# EAGLE design LOLDV22 (EAGLE 6.4)
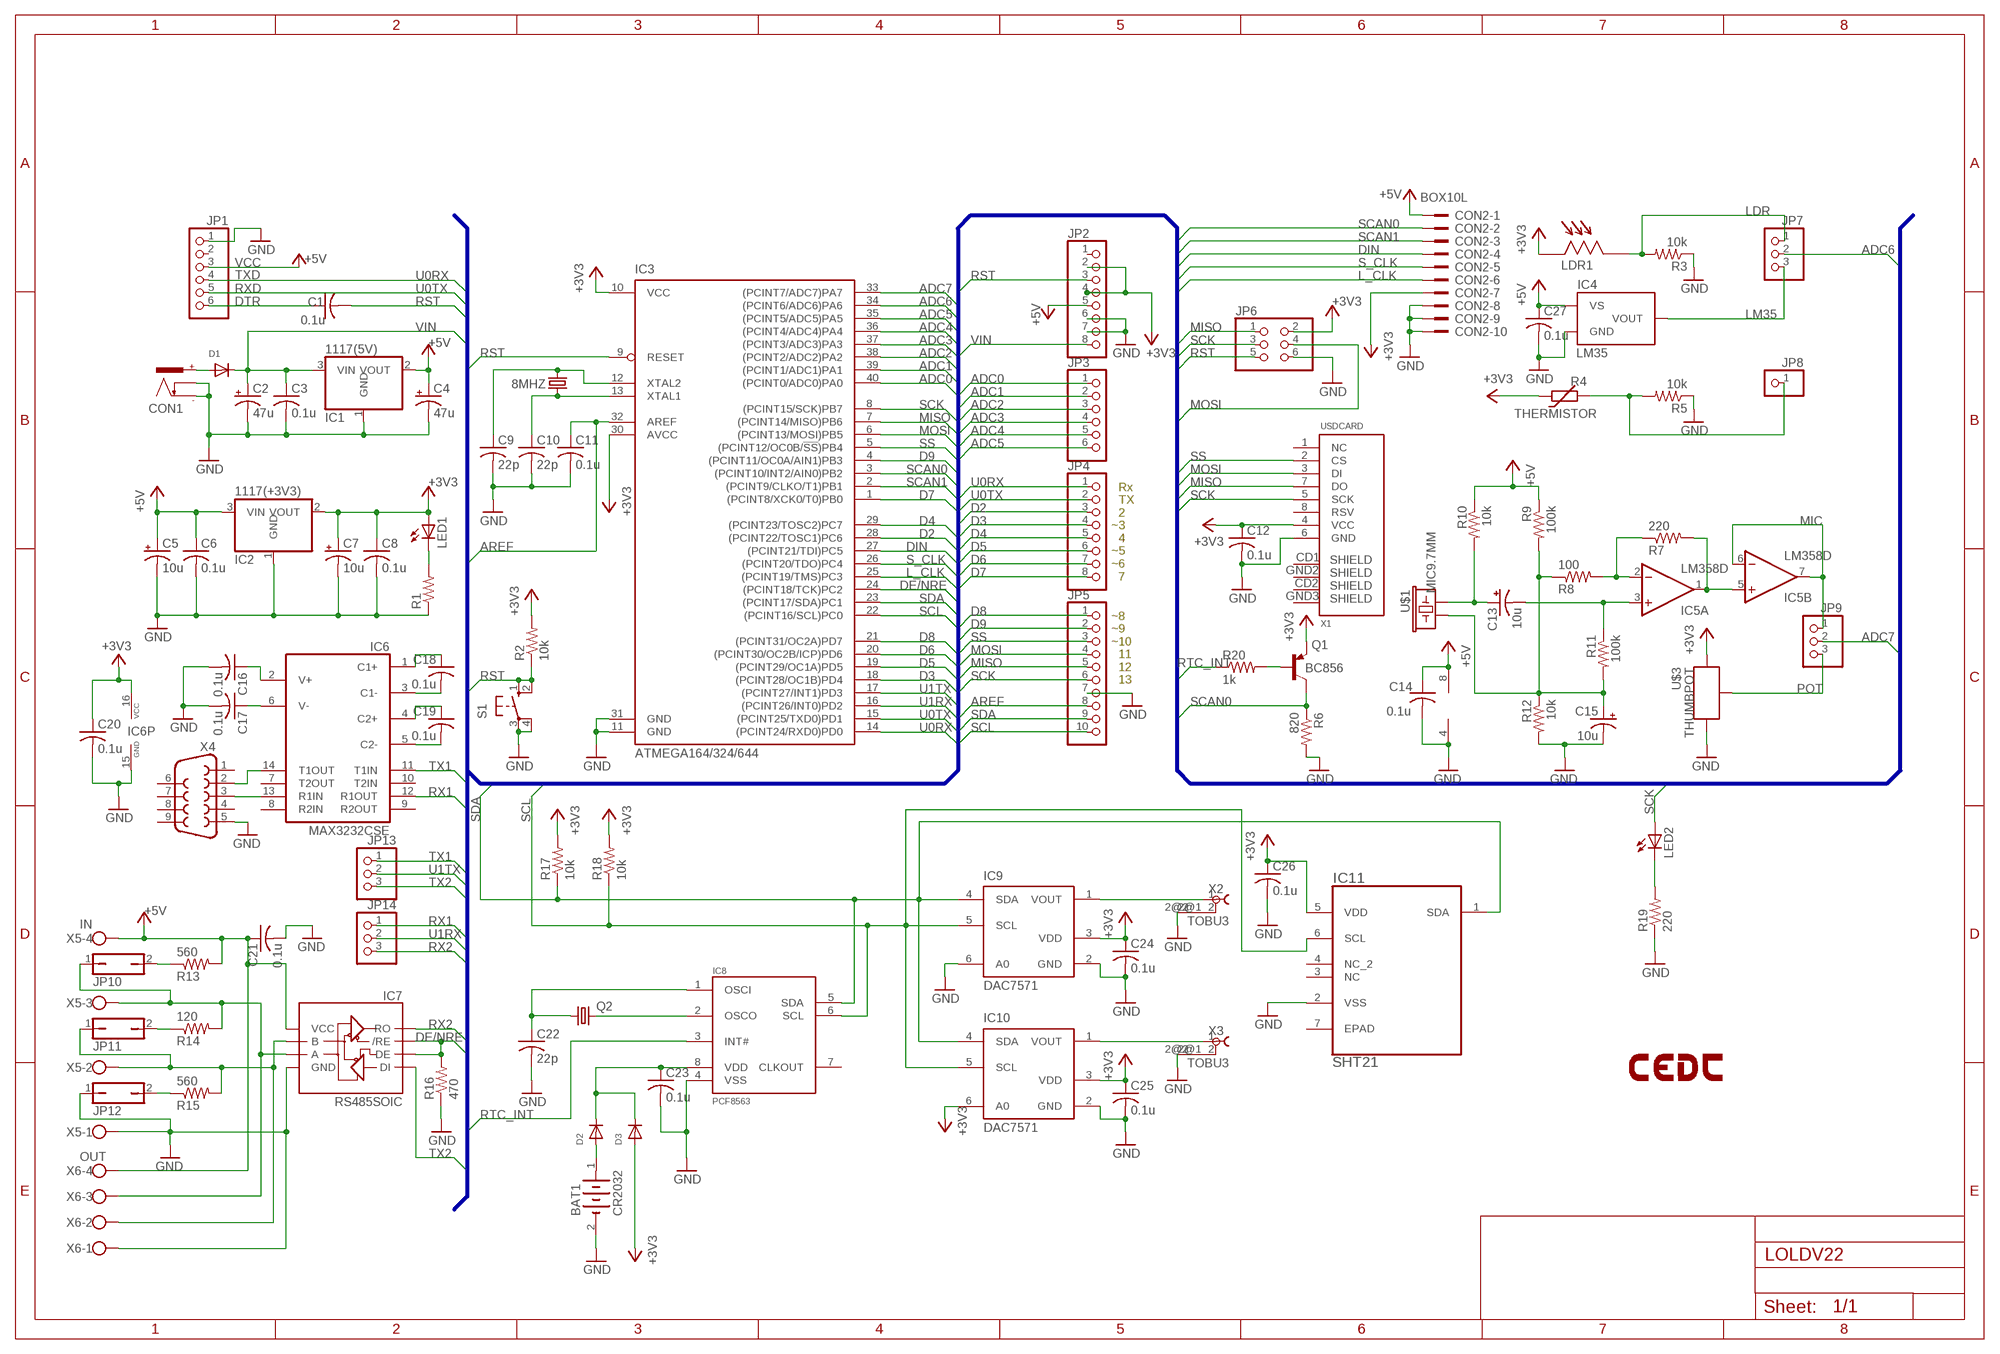
[diagram p0: schematic, sheet 1]

## Parts
8MHZ  CRYSTALHC49US  [HC49US]
BAT1  CR2032  [BATTCON_20MM]
C1  0.1u  CAP0805  [C0805]
C2  47u  CPOL-USE3.5-8  [E3,5-8]
C3  0.1u  CAP0805  [C0805]
C4  47u  CPOL-USE3.5-8  [E3,5-8]
C5  10u  CAP_POL_10V  [C/6032-28R]
C6  0.1u  CAP0805  [C0805]
C7  10u  CAP_POL_10V  [C/6032-28R]
C8  0.1u  CAP0805  [C0805]
C9  22p  CAP0805  [C0805]
C10  22p  CAP0805  [C0805]
C11  0.1u  CAP0805  [C0805]
C12  0.1u  CAP0805  [C0805]
C13  10u  CAP_POL_10V  [C/6032-28R]
C14  0.1u  CAP0805  [C0805]
C15  10u  CAP_POL_10V  [C/6032-28R]
C16  0.1u  CAP0805  [C0805]
C17  0.1u  CAP0805  [C0805]
C18  0.1u  CAP0805  [C0805]
C19  0.1u  CAP0805  [C0805]
C20  0.1u  CAP0805  [C0805]
C21  0.1u  CAP0805  [C0805]
C22  22p  CAP0805  [C0805]
C23  0.1u  CAP0805  [C0805]
C24  0.1u  CAP0805  [C0805]
C25  0.1u  CAP0805  [C0805]
C26  0.1u  CAP0805  [C0805]
C27  0.1u  CAP0805  [C0805]
CON1  POWER_CON  [NEB21R]
CON2  BOX10L  [BOX10L]
D1  DIODESMA  [SMADIODE]
D2  DIODESMA  [SMADIODE]
D3  DIODESMA  [SMADIODE]
IC1  1117(5V)  REG1117  [SOT223]
IC2  1117(+3V3)  REG1117  [SOT223]
IC3  ATMEGA164/324/644  [DIP40]
IC4  LM35  [TO92]
IC5  LM358D  [SO08]
IC6  MAX3232CSE  [SO16]
IC7  RS485SOIC  [SO08]
IC8  PCF8563  PCF8563SO8  [SOIC8]
IC9  DAC7571  [SOT23-6]
IC10  DAC7571  [SOT23-6]
IC11  SHT21  [DFN300X300X110-7N]
JP1  PINHD-1X6  [1X06]
JP2  PINHD-1X8  [1X08]
JP3  PINHD-1X6  [1X06]
JP4  PINHD-1X8  [1X08]
JP5  PINHD-1X10  [1X10]
JP6  PINHD-2X3  [2X03]
JP7  PINHD-1X3  [1X03]
JP8  PINHD-1X1  [1X01]
JP9  PINHD-1X3  [1X03]
JP10  JP1Q  [JP1]
JP11  JP1Q  [JP1]
JP12  JP1Q  [JP1]
JP13  PINHD-1X3  [1X03]
JP14  PINHD-1X3  [1X03]
LDR1  CDSLDR3MM  [LDR3MM]
LED1  LED1206  [CHIPLED_1206]
LED2  LED1206  [CHIPLED_1206]
LOGO1  LOGO-CEDTSILK-18MM  [LOGO-CEDT-SILK-18MM]
Q1  BC856  BC856ASMD  [SOT23-BEC]
Q2  CRYSTALTC26H  [TC26H]
R1  RESISTOR0805  [R0805]
R2  10k  RESISTOR0805  [R0805]
R3  10k  RESISTOR0805  [R0805]
R4  THERMISTOR  THERMISTOR-5  [R-5]
R5  10k  RESISTOR0805  [R0805]
R6  820  RESISTOR0805  [R0805]
R7  220  RESISTOR0805  [R0805]
R8  100  RESISTOR0805  [R0805]
R9  100k  RESISTOR0805  [R0805]
R10  10k  RESISTOR0805  [R0805]
R11  100k  RESISTOR0805  [R0805]
R12  10k  RESISTOR0805  [R0805]
R13  560  RESISTOR0805  [R0805]
R14  120  RESISTOR0805  [R0805]
R15  560  RESISTOR0805  [R0805]
R16  470  RESISTOR0805  [R0805]
R17  10k  RESISTOR0805  [R0805]
R18  10k  RESISTOR0805  [R0805]
R19  220  RESISTOR0805  [R0805]
R20  1k  RESISTOR0805  [R0805]
S1  10-XX  [B3F-10XX]
U$1  MIC9.7MM  [MIC-9.7MM]
U$3  THUMBPOT  [THUMBPOT]
X1  USDCARD  [USD-SOCKET-PUSHTYPE]
X2  TOBU3  [TOBU3]
X3  TOBU3  [TOBU3]
X4  DB9  [DB9]
X5  IN  W237-4  [W237-4]
X6  OUT  W237-4  [W237-4]

## Nets
16MHZ: 8MHZ.2 C9.1 IC3.12(XTAL2)
+3V3 [power]: C7.+ C8.1 C12.1 C20.1 C24.1 C25.1 C26.1 CON2.7 D3.A IC2.2(VOUT) IC3.10(VCC) IC3.30(AVCC) IC6.16(VCC) IC9.3(VDD) IC10.3(VDD) IC10.6(A0) IC11.5(VDD) JP2.2 JP2.4 JP6.2 LDR1.P$1 LED1.A Q1.E R2.2 R4.1 R17.2 R18.2 U$3.1(E) X1.4(VCC)
+5V [power]: C4.+ C5.+ C6.1 C14.1 C21.1 C27.1 CON2.1 IC1.2(VOUT) IC2.3(VIN) IC4.VS IC5.8(P:V+) IC7.8(VCC) JP1.3 JP2.5 R9.1 R10.1 R13.2 X5.4 X6.4
ADC0: IC3.40((PCINT0/ADC0)PA0) JP3.1
ADC1: IC3.39((PCINT1/ADC1)PA1) JP3.2
ADC2: IC3.38((PCINT2/ADC2)PA2) JP3.3
ADC3: IC3.37((PCINT3/ADC3)PA3) JP3.4
ADC4: IC3.36((PCINT4/ADC4)PA4) JP3.5
ADC5: IC3.35((PCINT5/ADC5)PA5) JP3.6
ADC6: IC3.34((PCINT6/ADC6)PA6) JP7.2
ADC7: IC3.33((PCINT7/ADC7)PA7) JP9.2
AREF: C11.1 IC3.32(AREF) JP5.8
D2: IC3.28((PCINT22/TOSC1)PC6) JP4.3
D3: IC3.18((PCINT28/OC1B)PD4) JP4.4
D4: IC3.29((PCINT23/TOSC2)PC7) JP4.5
D5: IC3.19((PCINT29/OC1A)PD5) JP4.6
D6: IC3.20((PCINT30/OC2B/ICP)PD6) JP4.7
D7: IC3.1((PCINT8/XCK0/T0)PB0) JP4.8
D8: IC3.21((PCINT31/OC2A)PD7) JP5.1
D9: IC3.4((PCINT11/OC0A/AIN1)PB3) JP5.2
DE/NRE: IC3.24((PCINT18/TCK)PC2) IC7.2(/RE) IC7.3(DE) R16.2
DIN: CON2.4 IC3.27((PCINT21/TDI)PC5)
DTR: C1.1 JP1.6
GND [power]: BAT1.2(-) C2.- C3.2 C4.- C5.- C6.2 C7.- C8.2 C9.2 C10.2 C11.2 C12.2 C14.2 C15.- C16.2 C17.2 C20.2 C21.2 C22.2 C23.2 C24.2 C25.2 C26.2 C27.2 CON1.- CON1.C CON2.8 CON2.9 CON2.10 IC1.1(GND) IC2.1(GND) IC3.11(GND) IC3.31(GND) IC4.GND IC5.4(P:V-) IC6.15(GND) IC7.5(GND) IC8.4(VSS) IC9.2(GND) IC9.6(A0) IC10.2(GND) IC11.2(VSS) JP1.1 JP2.6 JP2.7 JP5.7 JP6.6 JP12.1 R1.1 R3.1 R5.1 R6.2 R12.2 R16.1 R19.1 S1.3(P) S1.4(P1) U$3.3(A) X1.6(GND) X2.2@2 X3.2@2 X4.5 X5.1 X6.1
L_CLK: CON2.6 IC3.25((PCINT19/TMS)PC3)
LDR: JP7.1 LDR1.P$2 R3.2
LM35: IC4.VOUT JP7.3
MIC: IC5.6(B:-IN) IC5.7(B:OUT) JP9.1
MISO: IC3.7((PCINT14/MISO)PB6) JP5.5 JP6.1 X1.7(DO)
MOSI: IC3.6((PCINT13/MOSI)PB5) JP5.4 JP6.4 X1.3(DI)
N$1: 8MHZ.1 C10.1 IC3.13(XTAL1)
N$2: IC5.2(A:-IN) R7.1 R8.2
N$3: C13.+ R10.2 U$1.1
N$4 [power]: CON1.+ D1.A
N$5: C13.- IC5.3(A:+IN) R11.1
N$7: IC6.14(T1OUT) X4.2
N$8: IC5.1(A:OUT) IC5.5(B:+IN) R7.2
N$9: LED1.C R1.2
N$10: IC10.1(VOUT) X3.1
N$11: IC9.1(VOUT) X2.1
N$12: Q1.B R20.2
N$13: JP8.1 R4.2 R5.2
N$14 [power]: BAT1.1(+) D2.A
N$15: C19.1 IC6.4(C2+)
N$16: LED2.C R19.2
N$17: C19.2 IC6.5(C2-)
N$18: IC6.13(R1IN) X4.3
N$19: C18.2 IC6.3(C1-)
N$20: C18.1 IC6.1(C1+)
N$21: C17.1 IC6.6(V-)
N$22: C16.1 IC6.2(V+)
N$23: IC8.2(OSCO) Q2.2
N$24: C22.1 IC8.1(OSCI) Q2.1
N$25 [power]: C23.1 D2.C D3.C IC8.8(VDD)
N$26: IC7.7(B) JP11.1 R15.2 X5.2 X6.2
N$27: JP10.2 R13.1
N$33: C15.+ R8.1 R9.2 R11.2 R12.1 U$1.2
N$42: IC7.6(A) JP10.1 R14.2 X5.3 X6.3
N$43: JP11.2 R14.1
N$45: JP12.2 R15.1
POT: JP9.3 U$3.2(S)
RST: C1.2 IC3.9(RESET) JP2.3 JP6.5 R2.1 S1.1(S) S1.2(S1)
RTC_INT: IC8.3(INT#) R20.1
RX1: IC6.12(R1OUT) JP14.1
RX2: IC7.1(RO) JP14.3
S_CLK: CON2.5 IC3.26((PCINT20/TDO)PC4)
SCAN0: CON2.2 IC3.3((PCINT10/INT2/AIN0)PB2) Q1.C R6.1
SCAN1: CON2.3 IC3.2((PCINT9/CLKO/T1)PB1)
SCK: IC3.8((PCINT15/SCK)PB7) JP5.6 JP6.3 LED2.A X1.5(SCK)
SCL: IC3.22((PCINT16/SCL)PC0) IC8.6(SCL) IC9.5(SCL) IC10.5(SCL) IC11.6(SCL) JP5.10 R18.1
SDA: IC3.23((PCINT17/SDA)PC1) IC8.5(SDA) IC9.4(SDA) IC10.4(SDA) IC11.1(SDA) JP5.9 R17.1
SS: IC3.5((PCINT12/OC0B/!SS!)PB4) JP5.3 X1.2(CS)
TX1: IC6.11(T1IN) JP13.1
TX2: IC7.4(DI) JP13.3
U0RX: IC3.14((PCINT24/RXD0)PD0) JP1.4 JP4.1
U0TX: IC3.15((PCINT25/TXD0)PD1) JP1.5 JP4.2
U1RX: IC3.16((PCINT26/INT0)PD2) JP14.2
U1TX: IC3.17((PCINT27/INT1)PD3) JP13.2
VIN [power]: C2.+ C3.1 D1.C IC1.3(VIN) JP2.8
Unconnected: IC6.7(T2OUT) IC6.8(R2IN) IC6.9(R2OUT) IC6.10(T2IN) IC8.7(CLKOUT) IC11.3(NC) IC11.4(NC_2) IC11.7(EPAD) JP1.2 JP2.1 X1.1(NC) X1.8(RSV) X1.CD1 X1.CD2 X1.GND2 X1.GND3 X2.2 X2.2@1 X3.2 X3.2@1 X4.1 X4.4 X4.6 X4.7 X4.8 X4.9

## Buses
AREF,ADC[0..7],SS,MOSI,MISO,SCK,RX[1..2],TX[1..2],RST,VIN,SDA,SCL,PWM[0..4],GPIO[0..2],L_CLK,S_CLK,DIN,SCAN1,SCAN0,BBS,RTC_INT,D[2..9],DE/NRE,U0RX,U0TX,U1RX,U1TX

## Notes on the sheet
- VCC
- TXD
  RXD
- Rx 
    TX
    2
  ~3
    4
  ~5
  ~6
    7
- ~8
  ~9
  ~10
    11
    12
    13

## Library data of the parts
8MHZ Q2 = CEDTv73:CRYSTAL: Crystals Various standard crystals. Proven footprints. Spark Fun Electronics SKU : COM-00534
BAT1 = CEDTv73:CR2032
C1 C3 C6 C8-C12 C14 C16-C20 C22-C27 = CEDTv73:CAP
C2 C4 = resistor:CPOL-US: POLARIZED CAPACITOR, American symbol
C5 C7 C13 C15 = CEDTv73:CAP_POL
C21 = CEDTv63:CAP
CON1 = CEDTv73:POWER_CON: DC Power Connector
CON2 = CEDTv73:BOX10: 3M (TM) Pak 100 4-Wall Header Source: 3M
D1-D3 = adafruit:DIODE: Diode SMADIODE - SMA Surface Mount Package 20V 1A Schottky Diode Digikey: 641-1014-6-ND DO-1N4148 - Through Hole Small Current Diode SOD-123 20V 1 A (.5mV Vf) Schottky Diode - Digikey: MBRX120TPMSCT-ND SOD-323 10V 570mA (.38mV Vf, 3ns) Schottky Diode - Digikey: ZLLS410CT-ND SOD-523 30V 30mA Schottky Diode (RB751S-40TE61) - Digikey: RB751S-40TE61CT-ND SOT23-R/W - SOT23 Package (R = Solder Paste/Reflow Ovens, W = Hand-Soldering) BAT54Film 40V 300mA - Digikey: 497-7162-1-ND
IC1 IC2 = CEDTv73:REG1117: 800mA and 1A Low Dropout (LDO) Positive Regulator 1.8V, 2.5V, 2.85V, 3.3V, 5V, and Adj
IC3 = atmega_164_324_644:ATMEGA164/324/644
IC4 = CEDTv73:LM35
IC5 = CEDTv73:LM358: OP AMP also LM158; LM258; LM2904 Source: http://cache.national.com/ds/LM/LM158.pdf
IC6 = maxim:MAX3232*: True RS-232 Transceivers 3.0V to 5.5V, Low-Power up to 1Mbps, Using Four 0.1µF External Capacitors Source: http://pdfserv.maxim-ic.com/en/ds/MAX3222-MAX3241.pdf
IC7 = sparkfun:RS485
IC8 = CEDTv73:PCF8563
IC9 IC10 = CEDTv73:DAC7571
IC11 = SHT21:SHT21: SENSOR, HUMIDITY & TEMP; MPN: SHT21; OC_FARNELL: 1855468; OC_NEWARK: 20T1172; PACKAGE: DFN-6; SUPPLIER: SENSIRION
JP1 JP3 = pinhead:PINHD-1X6: PIN HEADER
JP2 JP4 = pinhead:PINHD-1X8: PIN HEADER
JP5 = pinhead:PINHD-1X10: PIN HEADER
JP6 = pinhead:PINHD-2X3: PIN HEADER
JP7 = jumper01x03:PINHD-1X3
JP8 = pinhead:PINHD-1X1: PIN HEADER
JP9 JP13 JP14 = pinhead:PINHD-1X3: PIN HEADER
JP10-JP12 = jumper:JP1Q: JUMPER
LDR1 = CEDTv73:CDSLDR3MM
LED1 LED2 = CEDTv73:LED
LOGO1 = CEDTv73:LOGO-CEDT
Q1 = transistor-pnp:BC856*: PNP Transistror
R1-R3 R5 R6 R17-R20 = CEDTv73:RESISTOR
R4 = varistor:THERMISTOR: THERMISTOR
R7-R12 = CEDTv71:RESISTOR
R13-R16 = CEDTv63:RESISTOR
S1 = CEDTv73:10-XX: OMRON SWITCH
U$1 = CEDTv73:MIC: Microphone Omni-directional electret microphone. 9.7mm standard diameter.
U$3 = CEDTv73:THUMBPOT
X1 = CEDTv73:USDCARD: Amphenol Micro SD None Push Connector Part No: - 114-00841-68-1-ND
X2 X3 = CEDTv73:TOBU3: Female Cinch CONNECTOR ( RCA Jack )
X4 = sparkfun:DB9: DB9 Connector Standard DB9 (D-Sub 9) serial connector. Can be used for CAN bus as well as RS485 and RS232. Footprint production proven. Spark Fun Electronics SKU : PRT-00429
X5 X6 = con-wago-500:W237-4: WAGO SCREW CLAMP

## Net classes
0 default: width 0.305 mm
1 power: width 0.406 mm

## Board
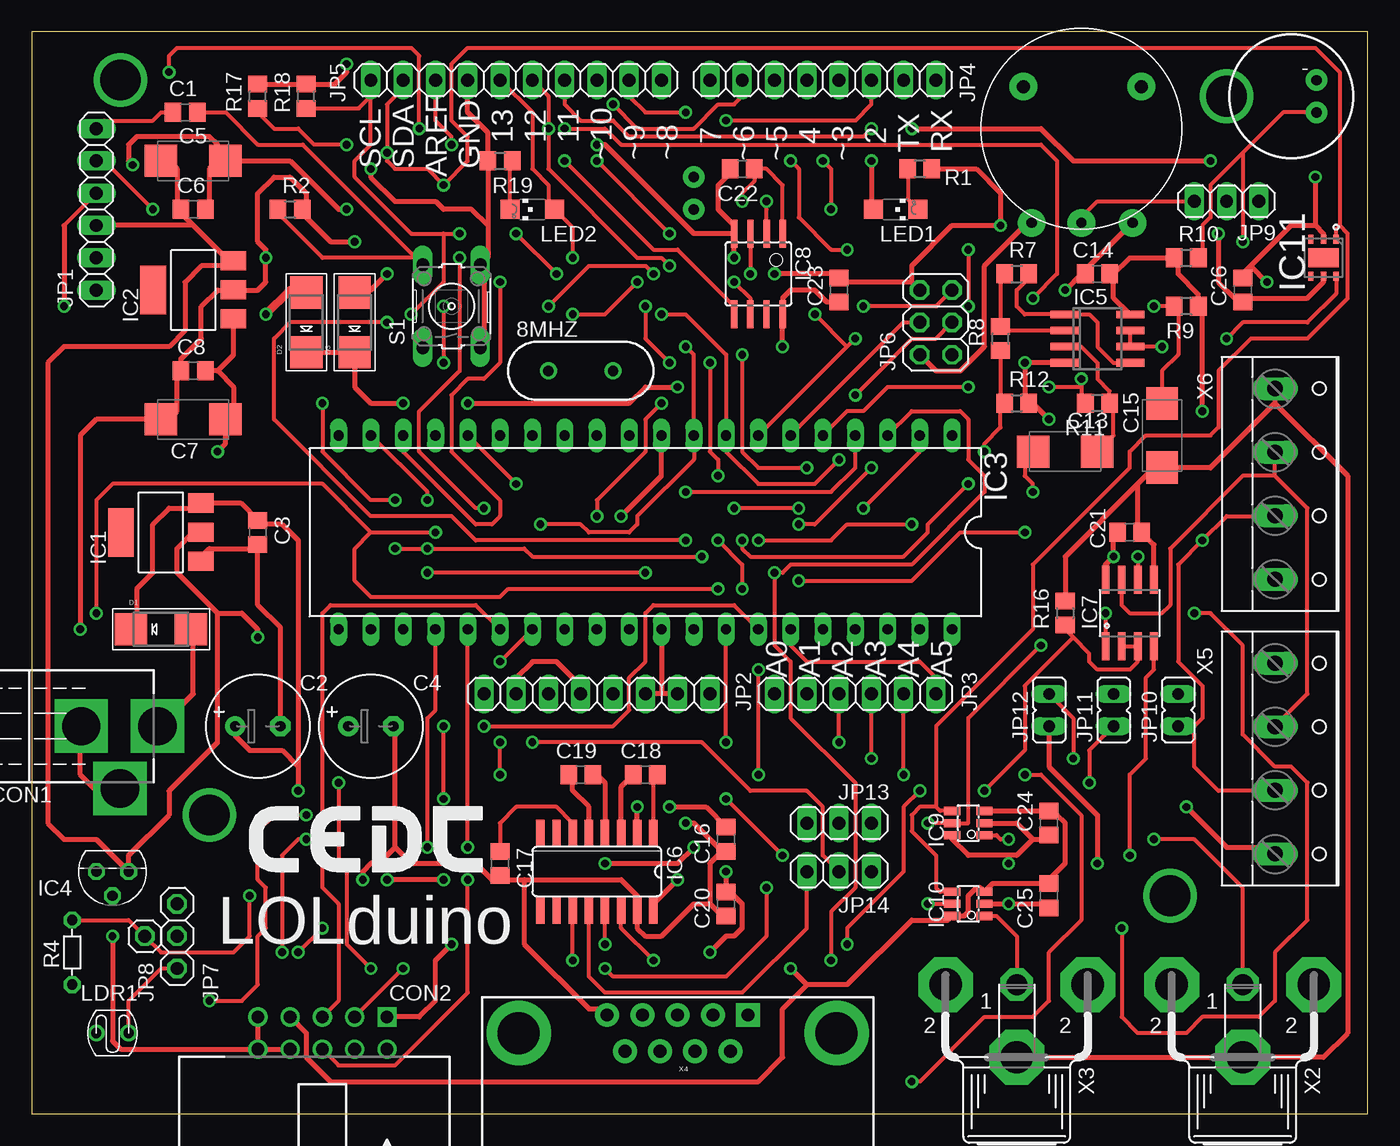
[diagram p1: board, top side]
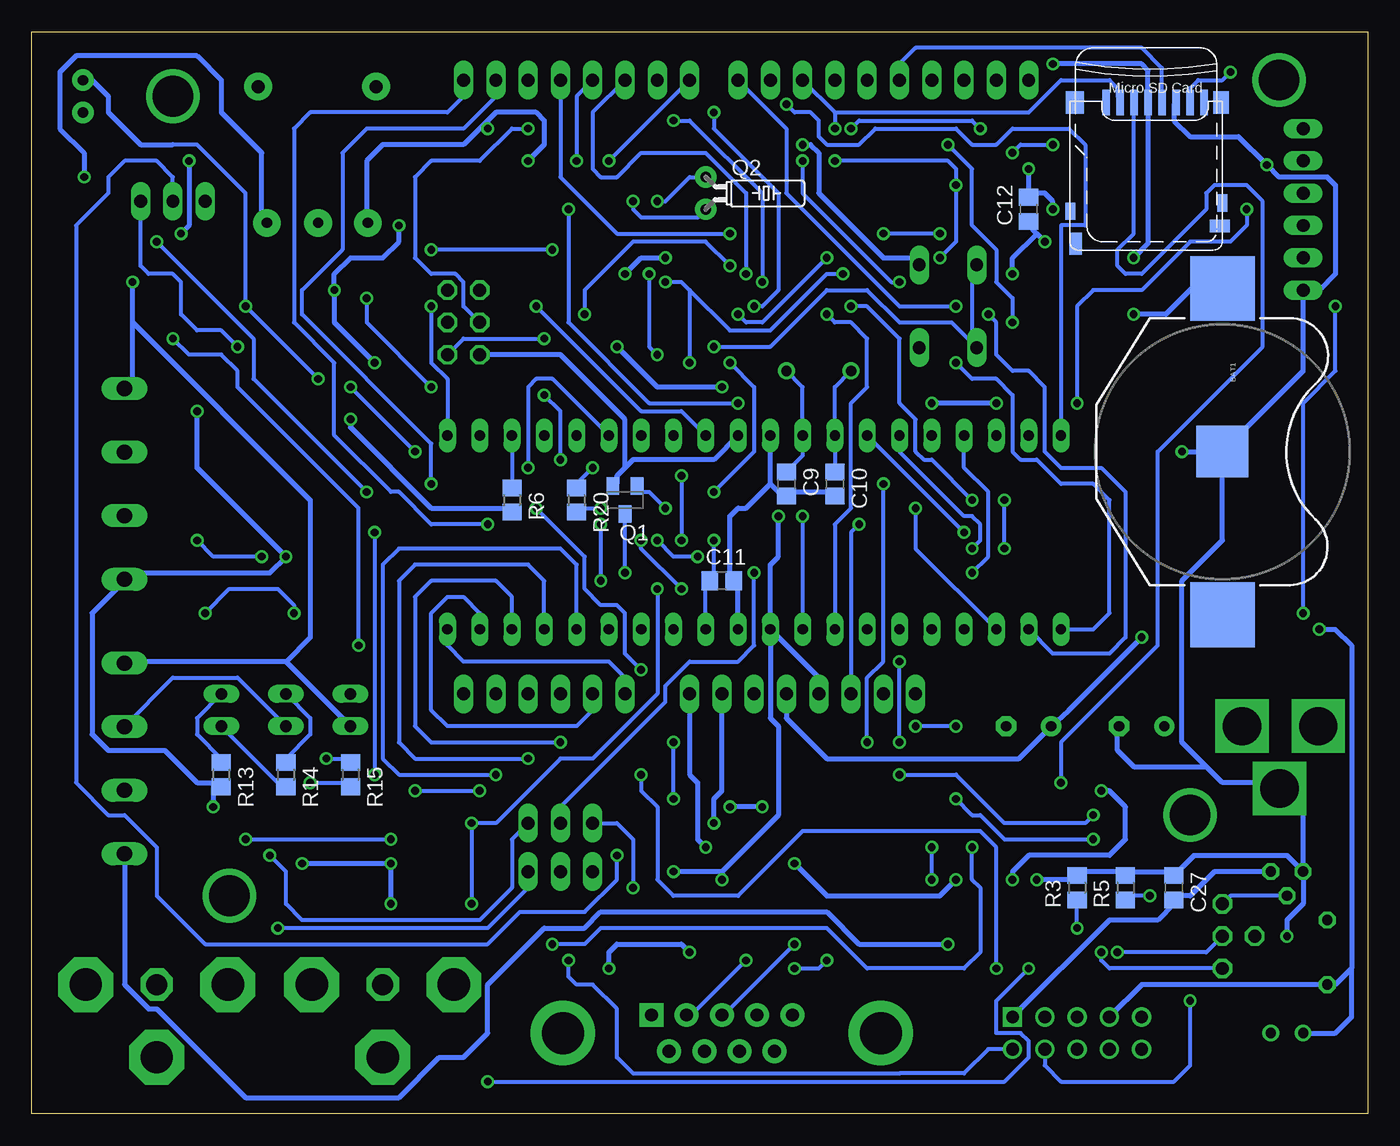
[diagram p2: board, bottom side, seen from below]

Size 105.08 x 85.08 mm. Coordinates in mm from the lower left corner, seen from the top.
Outline: 0,0 105.08,0 105.08,85.08 0,85.08 0,0
Copper layers (1*16): Top 0.035mm / dielectric 1.5mm / Bottom 0.035mm
Design rules "default *": minimum track width 12mil, minimum drill 24mil, track to track 12mil, track to pad 12mil, pad to pad 8mil, via to via 8mil, smd to smd 8mil, copper to edge 40mil, drill to drill 8mil, minimum pad ring 10mil, minimum via ring 8mil, stop-mask expansion 4mil, vias tented up to drill 0mil, thermal gap 10mil

### Footprints (pad centres in the part's own frame; a part is rotated, then mirrored left to right if it is on the bottom)
HC49US = drill 0.813: 1 -2.54,0; 2 2.54,0
BATTCON_20MM = smd 5.08 x 5.08: 1 -12.827,0; 3 12.827,0 | smd 4.064 x 4.064: 2 0,0
C0805 = smd 1.3 x 1.5: 1 -0.95,0; 2 0.95,0
E3,5-8 = drill 0.813 pad 1.6: + -1.778,0 | drill 0.813 pad 1.6 octagon: - 1.778,0
C/6032-28R = smd 2.55 x 2.5: + 2.525,0; - -2.525,0
NEB21R = drill 3 pad 4.2 square: + 0,3.54; - 0,-2.46; C 4.9,0.59
BOX10L = drill 1 pad 1.422 square: 1 -5.08,-1.27 | drill 1 pad 1.422: 2 -5.08,1.27; 3 -2.54,-1.27; 4 -2.54,1.27; 5 0,-1.27; 6 0,1.27; 7 2.54,-1.27; 8 2.54,1.27; 9 5.08,-1.27; 10 5.08,1.27
SMADIODE = smd 2.54 x 2.54: A 2.349,0; C -2.349,0
SOT223 = smd 1.499 x 2.007: 1 -2.261,-3.15; 2 0.025,-3.15; 3 2.311,-3.15 | smd 3.81 x 2.007: 4 0,3.15
DIP40 = drill 0.813 long: 1 -22.86,-7.62; 2 -20.32,-7.62; 3 -17.78,-7.62; 4 -15.24,-7.62; 5 -12.7,-7.62; 6 -10.16,-7.62; 7 -7.62,-7.62; 8 -5.08,-7.62; 9 -2.54,-7.62; 10 0,-7.62; 11 2.54,-7.62; 12 5.08,-7.62; 13 7.62,-7.62; 14 10.16,-7.62; 15 12.7,-7.62; 16 15.24,-7.62; 17 17.78,-7.62; 18 20.32,-7.62; 19 22.86,-7.62; 20 25.4,-7.62; 21 25.4,7.62; 22 22.86,7.62; 23 20.32,7.62; 24 17.78,7.62; 25 15.24,7.62; 26 12.7,7.62; 27 10.16,7.62; 28 7.62,7.62; 29 5.08,7.62; 30 2.54,7.62; 31 0,7.62; 32 -2.54,7.62; 33 -5.08,7.62; 34 -7.62,7.62; 35 -10.16,7.62; 36 -12.7,7.62; 37 -15.24,7.62; 38 -17.78,7.62; 39 -20.32,7.62; 40 -22.86,7.62
TO92 = drill 0.813 octagon: GND 1.27,0; VOUT 0,1.905; VS -1.27,0
SO08 = smd 0.6 x 2.2: 1 -1.905,-2.6; 2 -0.635,-2.6; 3 0.635,-2.6; 4 1.905,-2.6; 5 1.905,2.6; 6 0.635,2.6; 7 -0.635,2.6; 8 -1.905,2.6
SO16 = smd 0.66 x 2.032: 1 -4.445,-3.073; 2 -3.175,-3.073; 3 -1.905,-3.073; 4 -0.635,-3.073; 5 0.635,-3.073; 6 1.905,-3.073; 7 3.175,-3.073; 8 4.445,-3.073; 9 4.445,3.073; 10 3.175,3.073; 11 1.905,3.073; 12 0.635,3.073; 13 -0.635,3.073; 14 -1.905,3.073; 15 -3.175,3.073; 16 -4.445,3.073
SO08' = smd 0.61 x 2.21: 1 -1.905,-2.616; 2 -0.635,-2.616; 3 0.635,-2.616; 4 1.905,-2.616; 5 1.905,2.616; 6 0.635,2.616; 7 -0.635,2.616; 8 -1.905,2.616
SOIC8 = smd 0.5 x 2.2: 1 -1.905,-3.154; 2 -0.645,-3.154; 3 0.625,-3.154; 4 1.895,-3.154; 5 1.905,3.154; 6 0.635,3.154; 7 -0.635,3.154; 8 -1.905,3.154
SOT23-6 = smd 0.635 x 1.27: 1 -0.953,-1.27; 2 0,-1.27; 3 0.953,-1.27; 4 0.953,1.27; 5 0,1.27; 6 -0.953,1.27
DFN300X300X110-7N = smd 0.711 x 0.406: 1 -1.448,0.991; 2 -1.448,0; 3 -1.448,-0.991; 4 1.448,-0.991; 5 1.448,0; 6 1.448,0.991 | smd 1.499 x 2.388: 7 0,0
1X06 = drill 1.016 long: 1 -6.35,0; 2 -3.81,0; 3 -1.27,0; 4 1.27,0; 5 3.81,0; 6 6.35,0
1X08 = drill 1.016 long: 1 -8.89,0; 2 -6.35,0; 3 -3.81,0; 4 -1.27,0; 5 1.27,0; 6 3.81,0; 7 6.35,0; 8 8.89,0
1X10 = drill 1.016 long: 1 -11.43,0; 2 -8.89,0; 3 -6.35,0; 4 -3.81,0; 5 -1.27,0; 6 1.27,0; 7 3.81,0; 8 6.35,0; 9 8.89,0; 10 11.43,0
2X03 = drill 1.016 octagon: 1 -2.54,-1.27; 2 -2.54,1.27; 3 0,-1.27; 4 0,1.27; 5 2.54,-1.27; 6 2.54,1.27
1X03 = drill 1.016 octagon: 1 -2.54,0; 2 0,0; 3 2.54,0
1X01 = drill 1.016 octagon: 1 0,0
1X03' = drill 1.016 long: 1 -2.54,0; 2 0,0; 3 2.54,0
JP1 = drill 0.914 long: 1 0,-1.27; 2 0,1.27
LDR3MM = drill 0.8: P$1 0,0; P$2 2.54,0
CHIPLED_1206 = smd 1.5 x 1.5: A 0,-1.75; C 0,1.75
SOT23-BEC = smd 1 x 1.4: B -0.95,-1.1; C 0,1.1; E 0.95,-1.1
TC26H = drill 0.813 pad 1.676: 1 -1.27,0; 2 1.27,0
R0805 = smd 1.3 x 1.5: 1 -0.95,0; 2 0.95,0
R-5 = drill 0.813 octagon: 1 -2.54,0; 2 2.54,0
B3F-10XX = drill 1.016 long: 1 -3.251,2.261; 2 3.251,2.261; 3 -3.251,-2.261; 4 3.251,-2.261
MIC-9.7MM = drill 0.8 pad 1.676: 1 -2,1.27; 2 -2,-1.27
THUMBPOT = drill 0.8 pad 2.184: 1 -3.912,-7.417; 2 0,-7.417; 3 4.039,-7.417 | drill 1.016 pad 2.184: P$4 4.724,3.302; P$5 -4.547,3.302
USD-SOCKET-PUSHTYPE = smd 0.6 x 2: 1 9.15,4.3; 2 8.05,4.3; 3 6.95,4.3; 4 5.85,4.3; 5 4.75,4.3; 6 3.65,4.3; 7 2.55,4.3; 8 1.45,4.3 | smd 1.2 x 1.75: C1 0.1,4.3 | smd 1.4 x 1.75: C2 11.6,4.3 | smd 1 x 1.75: CD1 11.55,15.4 | smd 1.55 x 1: CD2 0.2,14 | smd 0.8 x 1.4: GND2 0,12.2 | smd 0.8 x 1.3: GND3 11.95,12.85
TOBU3 = drill 1.651 pad 2.54 octagon: 1 0,-2.54 | drill 2.54 pad 4.318 octagon: 2 5.588,-2.54; 2@1 -5.588,-2.54; 2@2 0,3.175
DB9 = drill 1.016 pad 1.88 square: 1 -5.54,-1.42 | drill 1.016 pad 1.88: 2 -2.77,-1.42; 3 0,-1.42; 4 2.77,-1.42; 5 5.54,-1.42; 6 -4.15,1.42; 7 -1.38,1.42; 8 1.38,1.42; 9 4.15,1.42 | drill 3.302 pad 5.08: G1 -12.5,0; G2 12.5,0
W237-4 = drill 1.194 long: 1 -7.5,-1.27; 2 -2.5,-1.27; 3 2.5,-1.27; 4 7.5,-1.27

### Placement (x,y rotation side)
8MHZ  43.18,58.42 0 top
BAT1  11.43,52.07 270 bottom
C1  12.06,78.74 0 top
C2  17.78,30.48 0 top
C3  17.78,45.72 270 top
C4  26.67,30.48 0 top
C5  12.7,74.93 180 top
C6  12.7,71.12 0 top
C7  12.7,54.61 180 top
C8  12.7,58.42 0 top
C9  45.72,49.53 270 bottom
C10  41.91,49.53 270 bottom
C11  50.8,41.91 0 bottom
C12  26.67,71.12 90 bottom
C13  81.28,52.07 180 top
C14  83.82,66.04 180 top
C15  88.9,53.34 90 top
C16  54.61,21.59 270 top
C17  36.83,19.68 270 top
C18  48.26,26.67 180 top
C19  43.18,26.67 180 top
C20  54.61,16.51 270 top
C21  86.36,45.72 0 top
C22  55.88,74.3 180 top
C23  63.5,64.77 90 top
C24  80.01,22.86 270 top
C25  80.01,17.14 270 top
C26  95.25,64.77 90 top
C27  15.24,17.78 90 bottom
CON1  6.35,30.48 270 top
CON2  22.86,6.35 180 top
D1  10.16,38.1 0 top
D2  21.59,62.23 90 top
D3  25.4,62.23 90 top
IC1  10.16,45.72 90 top
IC2  12.7,64.77 90 top
IC3  49.53,45.72 180 top
IC4  6.35,19.05 180 top
IC5  83.82,60.96 270 top
IC6  44.45,19.05 180 top
IC7  RS485SOIC  [SO08']  86.36,39.37 0 top
IC8  57.15,66.04 180 top
IC9  73.66,22.86 90 top
IC10  73.66,16.51 90 top
IC11  101.6,67.31 270 top
JP1  5.08,71.12 90 top
JP2  44.45,33.02 0 top
JP3  64.77,33.02 0 top
JP4  62.23,81.28 180 top
JP5  38.1,81.28 180 top
JP6  71.12,62.23 90 top
JP7  11.43,13.97 90 top
JP8  8.89,13.97 0 top
JP9  [1X03']  93.98,71.75 180 top
JP10  90.17,31.75 0 top
JP11  85.09,31.75 0 top
JP12  80.01,31.75 0 top
JP13  [1X03']  63.5,22.86 0 top
JP14  [1X03']  63.5,19.05 0 top
LDR1  5.08,6.35 0 top
LED1  67.94,71.12 270 top
LED2  39.37,71.12 90 top
LOGO1  17.14,19.05 0 top
Q1  58.42,48.26 180 bottom
Q2  52.07,72.39 270 bottom
R1  69.85,74.3 180 top
R2  20.32,71.12 0 top
R3  22.86,17.78 270 bottom
R4  3.17,12.7 90 top
R5  19.05,17.78 270 bottom
R6  67.31,48.26 270 bottom
R7  77.47,66.04 0 top
R8  76.2,60.96 90 top
R9  90.8,63.5 180 top
R10  90.8,67.31 0 top
R11  83.82,55.88 180 top
R12  77.47,55.88 0 top
R13  90.17,26.67 270 bottom
R14  85.09,26.67 270 bottom
R15  80.01,26.67 270 bottom
R16  81.28,39.37 270 top
R17  17.78,80.01 90 top
R18  21.59,80.01 90 top
R19  36.83,74.93 0 top
R20  62.23,48.26 270 bottom
S1  33.02,63.5 90 top
U$1  99.06,80.01 180 top
U$3  82.55,77.47 0 top
X1  11.43,83.82 180 bottom
X2  95.25,7.62 180 top
X3  77.47,7.62 180 top
X4  50.8,6.35 180 top
X5  99.06,27.94 270 top
X6  99.06,49.53 270 top

### Tracks (layer width: path | path; a pad name or v marks a point on that pad's centre or on a via)
16MHZ
  Bottom 0.305: 8MHZ.2 44.45,57.15 IC3.12 44.45,51.75 C9.1
+3V3  (via drill 0.61)
  Top 0.406: v66.04,74.93 66.04,71.12 LED1.A | JP6.2 71.12,58.42 73.02,58.42 74.93,60.33 74.93,66.67 78.1,69.85 U$3.1 | D3.A 25.4,64.77 26.67,64.77 v27.94,66.04 | JP2.4 43.18,33.66 41.28,35.56 39.37,35.56 38.1,34.29 JP2.2 | IC3.10 49.53,50.16 v46.36,46.99 | v25.4,68.58 23.5,68.58 21.59,70.48 21.59,71.12 R2.2 21.59,71.44 21.59,72.39 20.32,73.66 19.05,73.66 17.78,72.39 17.78,68.58 18.41,67.95 v18.41,67.31 18.41,65.41 17.78,64.77 15.88,64.77 IC2.2 15.24,64.77 14.61,64.77 13.33,63.5 13.33,60.96 11.75,59.38 C8.1 11.43,58.42 11.43,55.25 10.79,54.61 C7.+ 5.08,54.61 3.81,53.34 v3.81,38.1 | R18.2 R17.2 23.81,80.96 24.77,81.92 v24.77,82.55 | IC9.3 C24.1 80.01,23.49 80.64,23.49 81.28,22.86 81.28,19.68 80.01,18.41 C25.1 | C25.1 75.56,18.09 IC10.3 74.61,17.78 74.3,17.78 73.66,17.14 73.66,15.88 73.34,15.56 IC10.6 72.07,15.24 69.21,15.24 64.14,10.16 60.96,10.16 | 80.01,17.78 C25.1 | CON2.7 21.59,6.35 21.59,4.45 23.5,2.54 57.15,2.54 59.05,4.45 59.05,8.26 60.96,10.16 | 95.25,64.14 100.33,64.14 101.6,65.41 IC11.5 101.6,66.04 | v54.61,19.05 54.61,17.78 | v50.8,18.41 48.9,16.51 IC6.16 | 95.25,64.14 94.61,64.14 93.34,65.41 v93.34,69.22 | v92.71,74.93 81.91,74.93 79.38,77.47 v69.21,77.47 | 95.25,64.14 C26.1 | v53.34,12.7 54.61,13.97 55.25,13.97 55.88,14.61 55.88,16.51 54.61,17.78 | 54.61,17.78 C20.1 | 60.96,10.16 v59.69,11.43
  Bottom 0.406: v66.04,74.93 64.77,76.2 64.77,78.11 65.41,78.74 68.58,78.74 69.21,78.11 | 58.42,50.8 57.79,51.44 51.44,51.44 IC3.10 | 58.42,50.8 59.05,50.16 59.05,49.53 Q1.E | JP6.2 63.5,59.69 58.42,54.61 58.42,50.8 | IC3.30 43.18,34.29 JP2.4 | v46.36,46.99 46.36,43.82 46.99,43.18 IC3.30 | 78.54,70.05 U$3.1 78.74,70.16 78.74,74.93 77.47,76.2 71.12,76.2 69.21,78.11 | v25.4,68.58 26.04,69.22 | 26.04,69.22 26.67,69.85 C12.1 | v27.94,66.04 27.94,67.31 26.04,69.22 | v3.81,38.1 2.54,38.1 1.27,36.83 1.27,11.43 | 1.27,11.43 2.54,10.16 R4.1 17.78,10.16 CON2.7 | LDR1.P$1 2.54,6.35 1.27,7.62 1.27,11.43 | v24.77,82.55 17.78,82.55 17.28,82.05 X1.4 17.28,68.45 v18.41,67.31 | 50.8,19.05 v54.61,19.05 | 50.8,19.05 46.36,23.49 46.36,30.48 46.99,31.11 IC3.30 | 50.8,19.05 v50.8,18.41 | v93.34,69.22 92.71,69.85 v92.71,74.93 | 69.21,78.11 v69.21,77.47 | v59.69,11.43 59.69,12.7 59.05,13.34 53.98,13.34 v53.34,12.7
+5V  (via drill 0.61)
  Top 0.406: 11.43,71.12 11.43,74.3 10.79,74.93 C5.+ | 11.43,71.12 12.7,69.85 | 12.7,69.85 15.24,67.31 IC2.3 15.24,66.67 13.33,66.67 12.06,65.41 12.06,61.59 10.79,60.33 2.54,60.33 1.27,59.05 1.27,22.86 2.54,21.59 5.08,21.59 IC4.VS 7.62,20.32 10.79,23.49 10.79,25.4 14.61,29.21 14.61,39.37 | 11.43,71.12 C6.1 | 12.7,69.85 JP1.3 | 14.61,39.37 11.43,42.55 11.43,44.45 12.7,45.72 IC1.2 | 85.09,66.04 85.09,64.14 86.36,62.87 IC5.8 | 85.09,66.04 C14.1 | 89.53,67.31 R10.1 | 14.61,39.37 16.51,39.37 17.78,38.1 v17.78,37.47 | 85.09,66.04 86.36,67.31 R10.1 | R10.1 90.17,67 90.17,66.04 91.75,64.45 R9.1 92.08,63.5 v92.08,55.25 | IC7.8 84.45,43.18 v85.09,43.82 85.09,45.72 C21.1 | v90.8,24.13 93.98,20.95 97.79,20.95 X5.4 | CON2.1 30.48,7.62 31.75,8.89 31.75,12.07 v33.02,13.34
  Bottom 0.406: IC4.VS 12.06,19.05 13.97,17.14 15.24,17.14 C27.1 15.24,16.51 16.51,15.24 20.32,15.24 CON2.1 | v17.78,37.47 23.5,31.75 C4.+ 27.43,27.94 42.55,27.94 45.72,31.11 JP2.5 | 90.8,26.04 92.08,26.04 94.61,28.57 99.06,28.57 100.33,29.84 100.33,39.37 97.79,41.91 X6.4 97.79,42.55 86.36,42.55 v85.09,43.82 92.08,50.8 v92.08,55.25 | 90.8,26.04 90.17,26.04 R13.2 90.8,26.04 | 90.8,26.04 v90.8,24.13 | X5.4 97.79,10.16 95.88,8.26 95.25,8.26 88.27,1.27 76.2,1.27 73.02,4.45 71.12,4.45 69.21,6.35 69.21,10.16 64.77,14.61 61.6,14.61 60.33,15.88 42.55,15.88 40.01,13.34 v33.02,13.34
ADC0
  Bottom 0.305: JP3.1 58.42,34.29 59.69,35.56 71.12,35.56 72.39,36.83 IC3.40
ADC1
  Bottom 0.305: JP3.2 60.96,31.75 62.23,30.48 72.39,30.48 73.66,31.75 73.66,39.37 72.39,40.64 71.12,40.64 69.85,39.37 IC3.39
ADC2  (via drill 0.61)
  Top 0.305: v63.5,29.21 JP3.3
  Bottom 0.305: IC3.38 67.31,40.64 68.58,41.91 73.66,41.91 74.93,40.64 74.93,30.48 73.66,29.21 v63.5,29.21
ADC3  (via drill 0.61)
  Top 0.305: v66.04,27.94 JP3.4
  Bottom 0.305: IC3.37 64.77,41.91 66.04,43.18 74.93,43.18 76.2,41.91 76.2,29.21 74.93,27.94 v66.04,27.94
ADC4  (via drill 0.61)
  Top 0.305: v68.58,26.67 JP3.5
  Bottom 0.305: IC3.36 62.23,43.18 63.5,44.45 76.2,44.45 77.47,43.18 77.47,27.94 76.2,26.67 v68.58,26.67
ADC5
  Top 0.305: IC3.35 59.69,36.83 60.96,35.56 69.85,35.56 71.12,34.29 JP3.6
ADC6  (via drill 0.61)
  Top 0.305: IC3.34 55.25,40.01 48.9,40.01 48.26,39.37 48.26,35.56 46.99,34.29 46.99,31.75 45.72,30.48 v35.56,30.48 | v32.38,24.76 v32.38,30.48 | v21.59,21.59 20.95,21.59 19.68,20.32 v19.68,12.7
  Bottom 0.305: v32.38,30.48 v35.56,30.48 | v19.68,12.7 12.7,12.7 JP7.2 | v32.38,24.76 31.11,23.49 30.48,23.49 28.57,21.59 v21.59,21.59
ADC7  (via drill 0.61)
  Top 0.305: v54.61,29.21 IC3.33 | v59.05,20.32 v54.61,24.76
  Bottom 0.305: v54.61,24.76 v54.61,29.21 | v59.05,20.32 59.05,18.41 61.6,15.88 66.67,15.88 69.21,13.34 91.44,13.34 95.25,17.14 95.25,20.95 97.79,23.49 99.06,23.49 101.6,26.04 101.6,69.85 99.06,72.39 99.06,73.66 97.79,74.93 95.25,74.93 93.98,73.66 JP9.2
AREF  (via drill 0.61)
  Top 0.305: JP5.8 31.75,78.11 33.02,76.84 v33.02,76.2 | v51.44,45.09 34.93,45.09 33.02,46.99 26.67,46.99 19.05,54.61 19.05,60.96 20.32,62.23 v27.94,62.23
  Bottom 0.305: IC3.32 52.07,41.91 C11.1 51.44,41.91 v51.44,45.09 | v33.02,76.2 31.11,74.3 31.11,69.85 29.21,67.95 29.21,65.41 27.94,64.14 v27.94,62.23
D2  (via drill 0.61)
  Top 0.305: v54.61,78.11 64.77,78.11 66.04,79.38 JP4.3 | v42.55,62.87 45.09,62.87 v47.62,65.41
  Bottom 0.305: IC3.28 41.91,46.36 40.64,47.62 40.64,55.88 39.37,57.15 39.37,60.96 40.64,62.23 41.91,62.23 v42.55,62.87 | v47.62,65.41 47.62,72.39 53.34,78.11 v54.61,78.11
D3  (via drill 0.61)
  Top 0.305: IC3.18 29.21,52.07 34.93,46.36 36.2,46.36 36.83,46.99 36.83,48.26 33.02,52.07 33.02,56.52 34.29,57.79 35.56,57.79 36.83,59.05 v36.83,65.41 | v50.17,69.22 v44.45,74.93
  Bottom 0.305: v36.83,65.41 37.47,65.41 44.45,72.39 v44.45,74.93 | v50.17,69.22 59.05,69.22 63.5,73.66 JP4.4
D4  (via drill 0.61)
  Top 0.305: v44.45,46.99 44.45,48.26 48.26,52.07 48.26,54.61 v49.53,55.88 | v62.87,71.12 62.87,74.3 v62.23,74.93
  Bottom 0.305: v44.45,46.99 IC3.29 | v49.53,55.88 56.52,55.88 62.87,62.23 v62.87,71.12 | v62.23,74.93 62.23,80.01 JP4.5
D5  (via drill 0.61)
  Top 0.305: IC3.19 31.11,48.9 v31.11,48.26 | v48.9,66.04 48.26,66.67 43.82,66.67 v40.64,63.5
  Bottom 0.305: v31.11,48.26 34.29,51.44 34.93,51.44 35.56,52.07 35.56,54.61 36.83,55.88 36.83,60.96 39.37,63.5 v40.64,63.5 | v48.9,66.04 48.9,72.39 52.07,75.56 57.15,75.56 59.05,73.66 60.33,73.66 60.96,74.3 60.96,78.74 JP4.6
D6  (via drill 0.61)
  Top 0.305: JP4.7 55.88,80.01 55.25,79.38 53.98,79.38 52.07,77.47 47.62,77.47 v45.72,79.38
  Bottom 0.305: IC3.20 24.13,69.85 22.22,69.85 22.22,76.2 23.5,77.47 27.94,77.47 29.21,76.2 31.11,76.2 32.38,77.47 38.74,77.47 40.01,76.2 42.55,76.2 43.18,76.84 43.18,78.11 43.82,78.74 45.09,78.74 v45.72,79.38
D7  (via drill 0.61)
  Top 0.305: v73.66,67.95 v73.66,63.5 | v64.14,67.95 62.87,67.95 60.33,70.48 60.33,74.3 v59.69,74.93
  Bottom 0.305: IC3.1 72.39,57.79 73.66,59.05 v73.66,63.5 | v64.14,67.95 v73.66,67.95 | JP4.8 v59.69,74.93
D8  (via drill 0.61)
  Top 0.305: v32.38,63.5 v32.38,59.05
  Bottom 0.305: v32.38,63.5 36.83,63.5 45.72,72.39 45.72,77.47 JP5.1 | v32.38,59.05 31.11,57.79 29.21,57.79 27.94,56.52 27.94,52.07 27.3,51.44 26.04,51.44 24.13,49.53 21.59,49.53 20.32,48.26 20.32,39.37 21.59,38.1 IC3.21
D9  (via drill 0.61)
  Top 0.305: IC3.4 64.77,50.8 62.87,48.9 v51.44,48.9 | v48.26,63.5 48.26,60.96 v50.17,59.05 | JP5.2 46.99,80.01 48.26,78.74 v51.44,78.74
  Bottom 0.305: v51.44,48.9 48.26,52.07 48.26,57.15 v50.17,59.05 | v48.26,63.5 47.62,63.5 46.36,64.77 46.36,72.39 51.44,77.47 v51.44,78.74
DE/NRE  (via drill 0.61)
  Top 0.305: IC7.2 IC7.3 86.99,35.56 86.36,34.92 83.82,34.92 83.19,35.56 83.19,36.2 81.91,37.47 | 81.91,37.47 81.28,38.1 R16.2 | IC3.24 31.75,31.75 31.11,31.11 v31.11,20.95 | v64.14,13.34 64.14,14.61 68.58,19.05 68.58,24.13 v69.85,25.4 | v74.93,25.4 78.1,28.57 78.1,33.66 81.91,37.47
  Bottom 0.305: v31.11,20.95 31.11,18.41 30.48,17.78 30.48,12.7 31.75,11.43 39.37,11.43 42.55,14.61 60.33,14.61 61.6,13.34 v64.14,13.34 | v74.93,25.4 v69.85,25.4
DIN  (via drill 0.61)
  Top 0.305: v36.83,35.56 IC3.27 | v36.83,26.67 v36.83,29.21 | v13.97,8.89 16.51,8.89 17.78,10.16 17.78,13.97 18.41,14.61 18.41,17.78 17.78,18.41 17.78,22.22 19.05,23.49 v21.59,23.49
  Bottom 0.305: v36.83,29.21 v36.83,35.56 | CON2.4 25.4,3.81 24.13,2.54 15.24,2.54 13.97,3.81 v13.97,8.89 | v36.83,26.67 32.38,26.67 28.57,22.86 22.22,22.86 v21.59,23.49
DTR
  Top 0.305: JP1.6 5.71,78.11 9.53,78.11 10.16,78.74 C1.1
GND  (via drill 0.61)
  Top 0.406: S1.3 35.56,60.33 35.56,66.67 35.48,66.75 S1.4 35.88,67.35 35.88,69.85 | 14.61,74.93 13.97,74.3 13.97,71.12 C6.2 | 14.61,74.93 C5.- 20.32,74.93 24.13,71.12 v24.77,71.12 | 13.97,58.42 C8.2 14.61,58.42 | 28.57,20.95 29.84,19.68 34.93,19.68 36.2,18.41 36.51,18.41 C17.2 36.83,18.41 38.74,18.41 | 17.78,44.45 13.97,44.45 13.33,43.82 IC1.1 | 17.78,44.45 17.78,40.01 19.56,38.23 C2.- | 17.78,44.45 C3.2 | C22.2 55.25,74.3 53.98,73.03 53.98,71.12 55.25,69.85 55.25,69.2 IC8.4 | 69.21,65.41 63.5,65.41 C23.2 63.5,66.04 v58.42,66.04 | JP6.6 69.21,65.41 | v55.25,67.31 55.25,68.58 IC8.4 | 54.61,15.24 C20.2 54.61,15.88 53.98,15.88 53.34,16.51 | v44.45,76.2 45.09,76.2 52.07,69.22 55.25,69.22 IC8.4 | 14.61,74.93 14.61,76.2 13.97,76.84 8.26,76.84 7.62,76.2 7.62,74.93 v7.94,74.61 | CON1.C 4.9,25.58 3.81,26.67 3.81,30.4 CON1.- | JP5.7 34.29,78.74 35.88,77.15 R19.1 35.88,69.85 | 35.88,69.85 34.61,71.12 32.38,71.12 31.75,71.75 28.57,71.75 26.67,73.66 v26.67,74.3 | R1.1 74.3,74.3 76.2,72.39 v76.2,69.85 72.39,69.85 69.21,66.67 69.21,65.41 | IC5.4 v78.1,59.05 78.1,56.2 R12.2 | 82.55,66.04 v81.28,64.77 | IC10.2 v76.83,16.51 79.69,16.51 C25.2 | IC9.2 77.47,22.86 78.74,21.59 | 78.74,21.59 79.69,21.59 C24.2 | 76.83,20.32 77.47,20.32 78.74,21.59 | 76.83,20.32 73.66,20.32 72.39,21.59 IC9.6 | v76.83,19.68 76.83,20.32 | X3.2@2 X2.2@2 101.6,4.45 103.5,6.35 103.5,50.16 97.79,55.88 | 100.96,69.85 101.6,69.22 IC11.2 101.6,68.58 | 100.96,69.85 99.06,69.85 95.88,66.67 | 95.88,66.67 95.25,66.04 C26.2 | R16.1 81.28,43.82 86.99,49.53 | 88.27,50.8 88.9,51.44 C15.- | 88.27,50.8 C15.- | v97.16,65.41 95.88,66.67 | v83.82,19.68 83.82,23.49 80.01,27.3 JP12.1
  Top 0.406: JP2.7 49.53,33.02 | 49.53,33.02 JP2.6 | IC3.31 49.53,33.02 | CON2.9 CON2.10 | CON2.10 CON2.8 | 53.34,16.51 53.34,19.68 54.61,20.95 C16.2 54.61,20.32 52.07,22.86 v51.44,22.86 | 78.1,55.88 R12.2 | 38.74,18.41 46.36,18.41 47.62,17.14 IC6.15 47.62,14.61 48.26,13.97 49.53,13.97 52.07,16.51 53.34,16.51 | 38.74,18.41 38.74,13.34 43.82,8.26 45.09,8.26 X4.5 | 82.55,66.04 86.36,69.85 U$3.3 | 82.55,66.04 C14.2 | CON2.10 6.98,5.08 6.35,5.71 v6.35,13.97 | v100.96,73.66 100.96,69.85 | X6.1 97.79,55.88 | 97.79,55.88 92.71,50.8 88.91,50.8 C15.- | IC7.5 88.27,44.77 C21.2 86.99,45.72 86.99,49.53 | 86.99,49.53 88.27,50.8 | R12.2 78.74,55.88 v80.01,54.61 | IC2.1 15.85,59.66 14.61,58.42 | 14.61,58.42 15.88,57.15 15.88,55.26 C7.- 15.22,52.69 v14.61,52.07 | 28.57,20.95 28.57,30.35 C4.- | 28.57,20.95 27.3,19.68 26.67,19.68 26.04,19.05 v26.04,18.41
  Bottom 0.406: X1.6 15.24,79.38 15.24,78.11 13.97,76.84 10.16,76.84 v7.94,74.61 6.98,73.66 3.17,73.66 2.54,73.03 2.54,66.04 3.81,64.77 JP1.1 5.08,58.42 BAT1.2 | 19.05,19.05 15.24,19.05 C27.2 13.65,20.32 6.35,20.32 IC4.GND | 19.05,19.05 22.86,19.05 R3.1 22.86,18.41 v26.04,18.41 | 19.05,19.05 R5.1 | BAT1.2 11.43,45.09 14.61,41.91 14.61,29.21 12.7,27.3 | v55.25,67.31 57.15,67.31 v58.42,66.04 | C10.2 41.91,48.9 45.72,48.9 C9.2 45.72,48.26 46.99,49.53 | 46.99,49.53 IC3.11 | IC3.31 49.53,41.91 C11.2 50.17,41.91 50.17,46.99 49.53,47.62 48.9,47.62 46.99,49.53 | v44.45,76.2 43.82,76.2 43.18,75.56 43.18,72.39 38.1,67.31 35.56,67.31 S1.4 | v14.61,52.07 BAT1.2 | IC4.GND 5.08,23.72 CON1.C 7.39,26.04 11.43,26.04 12.06,26.67 12.7,27.3 | v24.77,71.12 24.77,71.75 25.4,72.39 26.35,72.39 C12.2 v26.67,74.3 | v78.1,59.05 81.28,62.23 v81.28,64.77 81.28,66.04 80.01,67.31 77.47,67.31 76.2,68.58 v76.2,69.85 | v76.83,16.51 v76.83,19.68 v83.82,19.68 | 97.16,62.23 97.16,57.79 97.79,57.15 X6.1 | 97.16,62.23 v97.16,65.41 | R6.2 67.31,47.62 73.66,47.62 80.01,53.98 v80.01,54.61 | v6.35,13.97 6.35,15.24 5.08,16.51 IC4.GND | JP2.7 50.8,25.4 51.44,24.76 v51.44,22.86 | U$3.3 86.99,70.48 86.99,75.56 90.17,78.74 90.17,81.28 92.08,83.19 101.6,83.19 102.87,81.92 102.87,77.47 100.96,75.56 v100.96,73.66 | 85.09,35.56 97.79,35.56 X5.1 | JP12.1 85.09,35.56 | 97.16,62.23 83.19,48.26 83.19,37.47 85.09,35.56 | C2.- 19.68,30.35 19.68,28.57 18.41,27.3 12.7,27.3
L_CLK  (via drill 0.61)
  Top 0.305: v34.29,20.95 IC3.25 | v34.29,18.41 34.29,9.53 28.57,3.81 24.13,3.81 CON2.6
  Bottom 0.305: v34.29,18.41 v34.29,20.95
LDR  (via drill 0.61)
  Top 0.305: LDR1.P$2 7.62,8.89 10.16,11.43 JP7.1 | v20.95,12.7 v22.86,14.61
  Bottom 0.305: v22.86,14.61 R3.2 | v20.95,12.7 20.95,12.07 20.32,11.43 JP7.1
LM35
  Bottom 0.305: IC4.VOUT 10.79,17.14 JP7.3
MIC  (via drill 0.61)
  Top 0.305: IC5.7 86.36,61.59 86.36,60.33 IC5.6 v88.9,60.33
  Bottom 0.305: v88.9,60.33 90.17,61.59 92.08,61.59 93.34,62.87 93.34,65.41 93.98,66.04 95.88,66.04 96.52,66.67 JP9.1
MISO  (via drill 0.61)
  Top 0.305: v64.77,60.96 64.14,60.33 | 64.14,60.33 IC3.7 | JP5.5 40.64,80.01 v40.64,77.47 40.64,74.3 47.62,67.31 49.53,67.31 v50.17,66.67 | v61.6,62.87 64.14,60.33 | v10.79,81.92 10.79,83.19 11.43,83.82 29.84,83.82 30.48,83.19 v30.48,77.47
  Bottom 0.305: v64.77,60.96 71.12,60.96 JP6.1 | v40.64,77.47 40.01,78.11 31.11,78.11 v30.48,77.47 | X1.7 13.97,80.01 13.97,80.64 13.33,81.28 11.43,81.28 v10.79,81.92 | v61.6,62.87 61.6,64.77 57.79,68.58 52.07,68.58 v50.17,66.67
MOSI  (via drill 0.61)
  Top 0.305: JP6.4 68.58,62.23 IC3.6 | v66.04,77.47 65.41,76.84 46.99,76.84 45.72,78.11 43.18,78.11 41.91,79.38 JP5.4 | v26.67,11.43 24.77,13.34 24.77,19.05 24.13,19.68 v24.13,26.04 | v78.1,26.67 79.38,26.67 82.55,23.49 82.55,15.24 80.01,12.7 80.01,8.89 78.74,7.62 74.93,7.62 69.85,2.54 v69.21,2.54 | v78.1,45.72 73.02,45.72 69.21,41.91 v60.33,41.91 | v60.33,46.36 61.6,46.36 v66.04,50.8
  Bottom 0.305: JP6.4 71.12,63.5 71.12,65.41 71.75,66.04 73.66,66.04 74.93,67.31 74.93,73.66 73.66,74.93 69.85,74.93 67.31,77.47 v66.04,77.47 | v26.67,11.43 29.21,8.89 29.21,6.35 27.3,6.35 26.67,5.71 26.67,4.45 28.57,2.54 v69.21,2.54 | v78.1,45.72 v78.1,26.67 | v60.33,46.36 v60.33,41.91 | v66.04,50.8 66.04,57.15 65.41,57.79 64.14,57.79 IC3.6 | X1.3 18.41,79.38 18.41,69.22 19.68,67.95 19.68,66.67 19.05,66.04 17.78,66.04 12.7,71.12 12.7,72.39 12.06,73.03 9.53,73.03 8.26,71.75 8.26,60.33 16.51,52.07 16.51,36.83 24.13,29.21 v24.13,26.04
N$1
  Bottom 0.305: C10.1 IC3.13 41.91,57.15 8MHZ.1
N$2
  Top 0.305: R7.1 76.2,66.04 R8.2 76.2,61.59 IC5.2
N$3  (via drill 0.61)
  Top 0.305: 95.25,75.56 98.42,78.74 U$1.1 | 95.25,75.56 92.71,73.03 92.71,70.48 92.08,69.85 92.08,67.31 R10.2 | 95.25,75.56 v95.25,68.58 | C13.+ 78.1,52.07 78.1,50.16 78.74,49.53 v78.74,48.9
  Bottom 0.305: v78.74,48.9 87.63,57.79 87.63,60.96 v95.25,68.58
N$4
  Top 0.406: CON1.+ 10.16,30.48 12.7,33.02 12.7,37.91 D1.A
N$5
  Top 0.305: IC5.3 82.55,60.33 83.82,59.05 83.82,57.79 84.77,56.84 R11.1 85.09,55.56 85.09,53.34 C13.-
N$7  (via drill 0.61)
  Top 0.305: IC6.14 46.36,14.61 v48.9,12.07
  Bottom 0.305: v48.9,12.07 53.34,7.62 X4.2
N$8
  Top 0.305: R7.2 78.1,66.04 78.1,65.41 77.47,64.77 77.47,63.5 78.1,62.87 IC5.1 83.19,62.87 83.82,62.23 83.82,60.33 85.09,59.05 IC5.5
N$9
  Top 0.305: 69.85,71.12 LED1.C 68.9,71.92 R1.2
N$10
  Top 0.305: IC10.1 75.88,15.56 77.47,13.97 X3.1
N$11  (via drill 0.61)
  Top 0.305: IC9.1 75.88,21.91 76.2,21.59 v76.83,21.59 | v88.27,21.59 91.44,21.59 95.25,17.78 X2.1
  Bottom 0.305: v88.27,21.59 v76.83,21.59
N$12  (via drill 0.61)
  Top 0.305: v60.33,47.62 v55.25,47.62
  Bottom 0.305: v60.33,47.62 62.23,47.62 R20.2 | Q1.B 57.15,48.9 56.52,48.9 v55.25,47.62
N$13  (via drill 0.61)
  Top 0.305: R4.2 7.62,15.24 JP8.1 10.16,12.7 15.88,12.7 17.14,13.97 v17.14,17.14
  Bottom 0.305: v17.14,17.14 19.05,17.14 R5.2
N$14  (via drill 0.61)
  Top 0.61: v18.41,62.87 20.32,64.77 21.4,64.77 D2.A
  Bottom 0.406: BAT1.1 13.84,64.9 15.88,62.87 v18.41,62.87
N$15
  Top 0.305: IC6.4 45.09,22.86
  Top 0.406: C19.1 44.45,26.67 45.09,26.04 45.09,22.86
N$16
  Top 0.305: LED2.C 37.62,74.77 R19.2
N$17
  Top 0.305: IC6.5 43.82,22.86
  Top 0.406: 43.82,22.86 43.82,24.13 42.55,25.4 42.55,26.36 C19.2
N$18  (via drill 0.61)
  Top 0.305: v45.09,13.34 IC6.13
  Bottom 0.305: v45.09,13.34 50.8,7.62 X4.3
N$19
  Top 0.305: IC6.3 46.36,22.86
  Top 0.406: 46.36,22.86 46.36,25.71 C18.2
N$20
  Top 0.305: IC6.1 48.9,26.67 C18.1
N$21
  Top 0.305: IC6.6 42.55,22.86 41.28,24.13 38.1,24.13 36.83,22.86 C17.1
N$22  (via drill 0.61)
  Top 0.406: IC6.2 v47.62,24.13 | v50.17,24.13 53.02,24.13 C16.1
  Bottom 0.406: v47.62,24.13 v50.17,24.13
N$23  (via drill 0.61)
  Top 0.305: IC8.2 57.8,71.11 v57.79,71.75
  Bottom 0.305: Q2.2 52.71,70.48 57.15,70.48 57.79,71.12 v57.79,71.75
N$24  (via drill 0.61)
  Top 0.305: IC8.1 59.05,73.03 57.79,74.3 C22.1 56.83,73.34 55.88,72.39 v55.88,71.75
  Bottom 0.305: v55.88,71.75 55.25,71.75 53.34,73.66 Q2.1
N$25  (via drill 0.61)
  Top 0.406: D2.C D3.C 25.4,57.15 26.67,55.88 v29.21,55.88 | v34.29,55.88 46.99,55.88 48.26,57.15 v50.8,57.15 | C23.1 62.55,63.82 61.6,64.77 59.69,64.77 59.05,64.14 IC8.8 v59.05,60.33
  Bottom 0.406: v29.21,55.88 v34.29,55.88 | v50.8,57.15 55.88,57.15 v59.05,60.33
N$26  (via drill 0.61)
  Top 0.305: v83.19,26.04 83.19,28.57 JP11.1 | 97.79,50.16 X6.2 | 97.79,50.16 100.33,47.62 100.33,33.02 97.79,30.48 X5.2 | IC7.7 85.72,40.01 86.36,39.37 88.9,39.37 89.53,40.01 89.53,44.45 95.25,50.16 97.79,50.16
  Bottom 0.305: v83.19,26.04 80.01,26.04 R15.2 | JP11.1 88.9,34.29 93.98,34.29 97.79,30.48 X5.2
N$27
  Bottom 0.305: JP10.2 92.08,31.11 92.08,29.84 90.17,27.94 R13.1
N$29  (via drill 3.2 pad 3.81)
  other vias: 6.98,81.28
N$30  (via drill 3.2 pad 3.81)
  other vias: 93.98,80.01
N$31  (via drill 3.2 pad 3.81)
  other vias: 13.97,23.49
N$32  (via drill 3.2 pad 3.81)
  other vias: 89.53,17.14
N$33  (via drill 0.61)
  Top 0.305: R8.1 76.2,55.88 | v82.55,57.79 82.55,57.15 | 82.55,57.15 82.55,55.88 R11.2 | v88.27,63.5 R9.2 90.17,63.5 90.17,59.69 88.9,58.42 C15.+ | 76.2,55.88 76.2,53.98 74.93,52.71 v74.93,52.07 | 82.55,57.15 v80.01,57.15 | 76.2,55.88 R12.1
  Bottom 0.305: v82.55,57.79 v88.27,63.5 88.27,72.39 92.08,76.2 93.98,76.2 | v80.01,57.15 v74.93,52.07
  Bottom 0.406: U$1.2 100.33,81.28 99.06,80.01 99.06,78.74 96.52,76.2 93.98,76.2
N$42  (via drill 0.61)
  Top 0.305: v86.99,43.82 IC7.6 | 97.79,46.99 X6.3 97.75,46.99 93.98,46.99 v92.08,45.09 90.17,43.18 90.17,35.56 92.08,33.66 92.08,31.11 91.44,30.48 90.8,30.48 | X5.3 97.79,25.4 93.34,25.4 91.44,27.3 91.44,29.84 90.8,30.48 | 90.8,30.48 JP10.1
  Bottom 0.305: JP10.1 85.72,26.04 85.09,26.04 R14.2 | v86.99,43.82 90.8,43.82 v92.08,45.09
N$43
  Bottom 0.305: JP11.2 83.19,31.11 83.19,29.84 85.09,27.94 R14.1
N$45  (via drill 0.61)
  Top 0.305: v81.91,27.94 81.91,31.11 JP12.2
  Bottom 0.305: v81.91,27.94 80.01,27.94 R15.1
POT
  Top 0.305: U$3.2 82.55,70.48 83.82,71.75 JP9.3
RST  (via drill 0.61)
  Top 0.305: R2.1 19.68,71.12 19.68,70.48 22.86,67.31 30.48,67.31 S1.2 21.31,76.2 17.78,76.2 15.24,78.74 C1.2 | v65.41,63.5 71.12,63.5 JP6.5 | v40.01,46.36 43.18,46.36 43.82,45.72 46.99,45.72 47.62,46.36 47.62,46.99 52.07,51.44 IC3.9 52.07,59.69 v51.44,60.33
  Bottom 0.305: IC3.9 53.98,55.25 57.15,55.25 v65.41,63.5 | JP2.3 40.64,45.72 v40.01,46.36 | v51.44,60.33 46.99,60.33 42.55,64.77 39.37,64.77 36.83,62.23 32.74,62.23 S1.1 31.11,60.6 31.11,66.67 31.04,66.75 S1.2
RTC_INT  (via drill 0.61)
  Top 0.305: v60.96,50.8 57.15,50.8 55.88,52.07 v55.88,59.69 | v56.52,66.04 56.52,68.58 IC8.3
  Bottom 0.305: v60.96,50.8 62.23,49.53 R20.1 | v55.88,59.69 56.52,60.33 v56.52,66.04
RX1
  Top 0.305: IC6.12 43.82,10.79 45.09,9.53 55.88,9.53 60.96,14.61 JP14.1
RX2  (via drill 0.61)
  Top 0.305: v84.45,39.37 IC7.1 | v85.72,14.61 85.72,7.62 86.99,6.35 90.8,6.35 92.08,7.62 96.52,7.62 97.79,8.89 97.79,12.7 100.33,15.24 100.33,26.04 99.06,27.3 97.79,27.3 95.25,29.84 95.25,36.83 92.71,39.37 v91.44,39.37
  Bottom 0.305: v85.72,14.61 69.21,14.61 66.04,17.78 JP14.3 | v91.44,39.37 89.53,41.28 85.72,41.28 84.45,40.01 v84.45,39.37
S_CLK
  Top 0.305: IC3.26 34.93,40.01 23.5,40.01 22.86,39.37 22.86,17.78 24.13,16.51 24.13,8.89 CON2.5
SCAN0  (via drill 0.61)
  Top 0.305: IC3.3 69.21,55.25 73.02,55.25 73.66,54.61 73.66,51.44 74.93,50.16 74.93,48.9 69.21,43.18 59.69,43.18 59.05,42.55 v58.42,42.55 58.42,36.83 59.69,35.56 59.69,31.11 64.77,26.04 64.77,17.78 62.87,15.88 v62.87,12.07
  Bottom 0.305: v58.42,42.55 Q1.C | IC3.3 R6.1 | v62.87,12.07 62.87,10.79 62.23,10.16 60.96,10.16 59.05,8.26 59.05,4.45 57.79,3.17 38.74,3.17 36.83,3.17 31.75,3.17 29.84,5.08 CON2.2
SCAN1  (via drill 0.61)
  Top 0.305: IC3.2 69.85,52.07 v65.41,47.62 | v57.15,26.67 v57.15,34.92 | CON2.3 v29.21,11.43
  Bottom 0.305: v65.41,47.62 61.6,43.82 61.6,41.28 60.33,40.01 59.05,40.01 58.42,39.37 58.42,36.2 v57.15,34.92 | v29.21,11.43 29.21,20.95 30.48,22.22 44.45,22.22 49.53,17.14 54.61,17.14 55.88,18.41 55.88,24.13 57.15,25.4 v57.15,26.67
SCK  (via drill 0.61)
  Top 0.305: JP5.6 39.37,78.74 39.37,74.3 40.64,73.03 40.64,71.6 LED2.A 42.55,69.7 v42.55,67.31 | v49.53,62.87 51.44,62.87 54.61,59.69 IC3.8 54.61,52.07 57.15,49.53 61.6,49.53 v63.5,51.44 | JP6.3 71.12,60.96 69.21,60.96 v64.77,56.52
  Bottom 0.305: X1.5 16.18,82.22 17.78,83.82 35.56,83.82 36.83,82.55 JP5.6 | v49.53,62.87 48.9,62.23 47.62,62.23 v42.55,67.31 | v64.77,56.52 63.5,55.25 v63.5,51.44
SCL  (via drill 0.61)
  Top 0.305: IC8.6 56.52,64.14 v55.25,65.41 | v38.1,69.22 v41.28,66.04 | 32.38,69.22 29.84,69.22 25.4,73.66 25.4,74.93 26.67,76.2 26.67,80.01 | 32.38,69.22 v33.66,69.22 | v29.84,62.87 32.38,65.41 32.38,69.22 | 26.67,80.01 JP5.10 | R18.1 25.72,79.06 26.67,80.01 | IC11.6 102.59,64.49 100.33,62.23 95.25,62.23 v93.98,60.96 | v79.38,36.83 73.66,31.11 73.66,22.86 IC9.5 v70.48,22.86 | v70.48,16.51 IC10.5 | v55.88,41.28 55.88,43.18 v53.98,45.09 | v53.98,50.16 53.98,51.44 53.34,52.07 v53.34,59.05
  Bottom 0.305: v55.25,65.41 53.98,65.41 53.34,64.77 | 53.34,64.77 50.17,61.59 46.99,61.59 42.55,66.04 v41.28,66.04 | v33.66,69.22 v38.1,69.22 | IC3.22 24.77,36.2 20.32,36.2 19.05,37.47 19.05,48.9 20.95,50.8 24.13,50.8 25.4,52.07 25.4,57.15 26.67,58.42 27.94,58.42 29.21,59.69 29.21,62.23 v29.84,62.87 | v79.38,36.83 79.38,47.62 88.9,57.15 88.9,58.42 90.17,59.69 92.71,59.69 v93.98,60.96 | v70.48,16.51 v70.48,22.86 68.58,22.86 63.5,27.94 60.96,27.94 55.88,33.02 v55.88,41.28 | v53.98,50.16 v53.98,45.09 | 53.34,64.77 v53.34,59.05
SDA  (via drill 0.61)
  Top 0.305: v41.91,74.93 48.9,67.95 50.8,67.95 55.25,63.5 IC8.5 | v33.66,67.31 33.66,58.42 30.48,55.25 30.48,52.07 34.93,47.62 v35.56,47.62 | JP5.9 29.21,80.64 27.94,79.38 v27.94,75.56 27.94,74.93 28.57,74.3 31.11,74.3 v32.38,73.03 34.29,74.93 34.29,76.84 33.02,78.11 33.02,82.55 34.29,83.82 100.96,83.82 102.87,81.92 102.87,69.85 | v24.77,76.2 22.22,76.2 20.95,77.47 19.05,77.47 17.78,78.74 R17.1 | 102.87,69.85 102.59,69.57 IC11.1 102.69,68.76 | IC10.4 71.44,17.46 71.12,17.78 71.12,20.32 69.21,22.22 69.21,23.49 69.85,24.13 71.12,24.13 | IC9.4 71.44,23.81 71.12,24.13 | 71.12,24.13 71.12,30.48 78.74,38.1 78.74,43.18 86.36,50.8 86.36,52.07 87.63,53.34 92.71,53.34 93.34,53.98 93.34,58.42 95.88,60.96 100.33,60.96 103.5,64.14 103.5,69.22 102.87,69.85
  Bottom 0.305: v41.91,74.93 33.02,74.93 32.38,74.3 v32.38,73.03 32.38,68.58 v33.66,67.31 | IC3.23 35.56,44.45 v35.56,47.62 | v24.77,76.2 27.3,76.2 v27.94,75.56
SS  (via drill 0.61)
  Top 0.305: IC3.5 64.14,55.25 65.41,55.25 67.31,57.15 v73.66,57.15 | v78.74,64.14 80.64,66.04 80.64,74.93 79.38,76.2 46.36,76.2 45.09,77.47 v41.91,77.47
  Bottom 0.305: 41.91,78.74 26.67,78.74 24.13,81.28 20.32,81.28 19.68,80.64 19.68,80.01 X1.2 | JP5.3 41.91,78.74 | v73.66,57.15 78.74,62.23 v78.74,64.14 | 41.91,78.74 v41.91,77.47
TX1  (via drill 0.61)
  Top 0.305: v45.09,11.43 45.72,10.79 54.61,10.79 57.79,13.97 v57.79,17.78 | v42.55,12.07 IC6.11
  Bottom 0.305: JP13.1 59.05,22.86 57.79,21.59 v57.79,17.78 | v45.09,11.43 43.18,11.43 v42.55,12.07
TX2  (via drill 0.61)
  Top 0.305: 88.27,36.83 IC7.4 88.27,34.92 87.63,34.29 87.63,27.94 86.36,26.67 v86.36,20.32
  Bottom 0.305: JP13.3 67.31,21.59 67.31,17.78 69.85,15.24 83.82,15.24 85.09,16.51 85.09,19.05 v86.36,20.32
U0RX  (via drill 0.61)
  Top 0.305: 26.67,45.72 v31.75,45.72 | JP1.4 2.54,69.85 | v69.21,46.36 64.14,46.36 62.87,45.09 v57.15,45.09 | v53.98,41.28 37.47,41.28 36.83,40.64 26.67,40.64 25.4,41.91 25.4,44.45 26.67,45.72 | 26.67,45.72 22.86,49.53 6.35,49.53 5.08,48.26 v5.08,39.37
  Top 0.406: 2.54,69.85 v2.54,63.5
  Bottom 0.305: v31.75,45.72 IC3.14 | v69.21,46.36 73.66,46.36 76.2,48.9 76.83,48.9 81.28,53.34 81.28,59.05 84.45,62.23 84.45,77.47 83.19,78.74 72.39,78.74 71.12,80.01 JP4.1 | v57.15,45.09 57.15,44.45 v53.98,41.28 | v5.08,39.37 5.08,55.88 2.54,58.42 v2.54,63.5
U0TX  (via drill 0.61)
  Top 0.305: v28.57,44.45 v31.11,44.45 38.74,44.45 39.37,43.82 v52.71,43.82 | v9.53,71.12 5.71,74.93 JP1.5 | v73.66,49.53 70.48,46.36 70.48,45.72 68.58,43.82 56.52,43.82 55.88,44.45 v55.88,45.09 | v22.86,55.88 22.86,52.07 26.67,48.26 v28.57,48.26
  Bottom 0.305: IC3.15 36.83,52.07 31.75,46.99 31.11,46.99 30.48,46.36 30.48,45.09 v31.11,44.45 | v9.53,71.12 9.53,69.85 10.79,68.58 13.97,68.58 17.78,64.77 21.59,64.77 22.86,63.5 v22.86,55.88 | v73.66,49.53 73.66,52.71 83.82,62.87 83.82,64.77 80.64,67.95 80.64,75.56 78.74,77.47 71.12,77.47 68.58,80.01 JP4.2 | v55.88,45.09 54.61,43.82 v52.71,43.82 | v28.57,44.45 v28.57,48.26
U1RX  (via drill 0.61)
  Top 0.305: v38.1,49.53 IC3.16 | v39.37,29.21 52.71,29.21 56.52,25.4 60.96,25.4 62.23,24.13 62.23,20.32 JP14.2
  Bottom 0.305: v38.1,49.53 38.1,35.56 39.37,34.29 v39.37,29.21
U1TX  (via drill 0.61)
  Top 0.305: v48.26,42.55 v31.11,42.55
  Bottom 0.305: IC3.17 31.75,50.8 29.84,48.9 29.84,43.82 v31.11,42.55 | v48.26,42.55 48.26,36.83 49.53,35.56 53.34,35.56 55.25,33.66 55.25,32.38 63.5,24.13 JP13.2
VIN  (via drill 0.61)
  Top 0.406: 20.95,27.3 20.95,45.09 19.68,46.36 18.09,46.36 C3.1 16.42,48.03 IC1.3 12.9,47.62 10.79,47.62 9.53,46.36 9.53,42.55 8.26,41.28 8.26,38.54 D1.C | 20.95,27.3 v20.95,25.4 | C2.+ 16,29.72 17.14,28.57 19.68,28.57 20.95,27.3 | v32.38,18.41 v27.94,18.41 | v45.09,19.68 50.8,19.68 v52.07,20.95
  Bottom 0.406: v27.94,18.41 27.94,19.05 26.67,20.32 20.32,20.32 19.05,21.59 19.05,24.13 20.32,25.4 v20.95,25.4 | v45.09,19.68 42.55,17.14 33.66,17.14 v32.38,18.41 | JP2.8 53.34,26.67 52.71,26.04 52.71,21.59 v52.07,20.95

### Text on the board
tPlace: 7 / ~6 / ~5 / 4 / ~3 / 2 / TX / RX | SCL / SDA / AREF / GND / 13 / 12 / 11 / ~10 / ~9 / ~8 | A0 / A1 / A2 / A3 / A4 / A5 | LOLduino